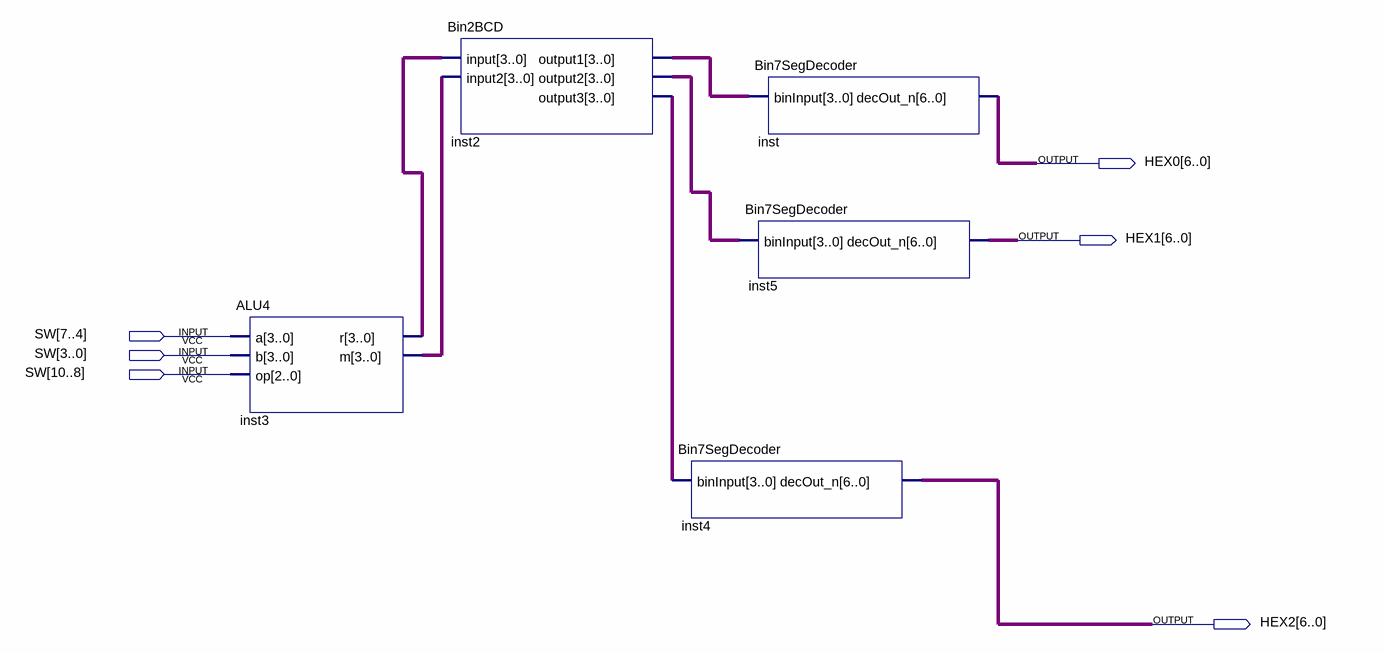
[diagram p0: schematic sheet]
// Quartus schematic ALUDemo.bdf as structural Verilog: 5 symbols, 6 pins
module ALUDemo (
  input  [10:0] SW,
  output [6:0] HEX0,
  output [6:0] HEX1,
  output [6:0] HEX2
);

  wire [3:0] inst2_output1, inst2_output2, inst2_output3, inst3_m, inst3_r;

  ALU4 inst3 (.a(SW[7:4]), .b(SW[3:0]), .op(SW[10:8]), .r(inst3_r), .m(inst3_m));
  Bin2BCD inst2 (
    .\input (inst3_r), .input2(inst3_m), .output1(inst2_output1), .output2(inst2_output2),
    .output3(inst2_output3));
  Bin7SegDecoder inst4 (.binInput(inst2_output3), .decOut_n(HEX2));
  Bin7SegDecoder inst (.binInput(inst2_output1), .decOut_n(HEX0));
  Bin7SegDecoder inst5 (.binInput(inst2_output2), .decOut_n(HEX1));
endmodule
